# Altium schematic sheet Fly-Back.SchDoc
size A4; DocumentNumber: 3; SheetNumber: 3; SheetTotal: 5
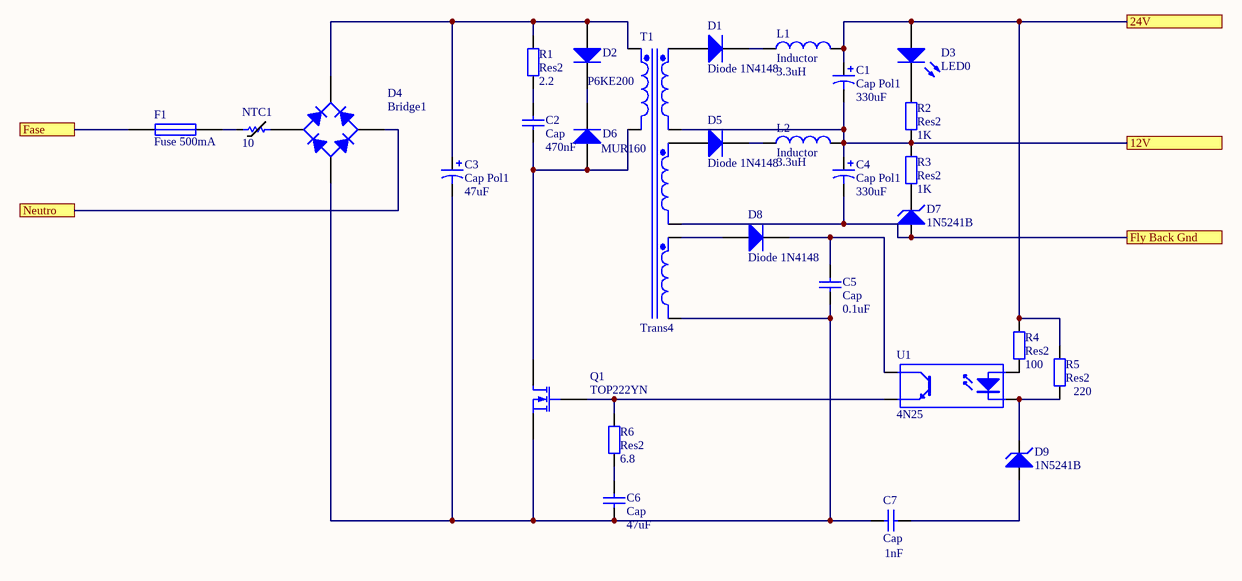
[diagram p0: Fly-Back.SchDoc]

## Parts
C1  Cap Pol1  value 330uF  [RB7.6-15]
C2  Cap  value 470nF  [RAD-0.3]
C3  Cap Pol1  value 47uF  [RB7.6-15]
C4  Cap Pol1  value 330uF  [RB7.6-15]
C5  Cap  value 0.1uF  [RAD-0.3]
C6  Cap  value 47uF  [RAD-0.3]
C7  Cap  value 1nF  [RAD-0.3]
D1  Diode 1N4148  [DO-35]
D2  P6KE200  [DO-35]
D3  LED0  [LED-0]
D4  Bridge1  [D-38]
D5  Diode 1N4148  [DO-35]
D6  MUR160  [DO-35]
D7  VALOR: 1N5241B  [DO-41]  (hidden comment: Diodo Zener)
D8  Diode 1N4148  [DO-35]
D9  VALOR: 1N5241B  [DO-41]  (hidden comment: Diodo Zener)
F1  Fuse 500mA  [PIN-W2/E2.8]
L1  Inductor  value 3.3uH  [0402-A]
L2  Inductor  value 3.3uH  [0402-A]
NTC1  VALOR: 10  [R0805]  (hidden comment: Termistor NTC)
Q1  TOP222YN  [E3]
R1  Res2  value 2.2  [AXIAL-0.4]
R2  Res2  value 1K  [AXIAL-0.4]
R3  Res2  value 1K  [AXIAL-0.4]
R4  Res2  value 100  [AXIAL-0.4]
R5  Res2  value 220  [AXIAL-0.4]
R6  Res2  value 6.8  [AXIAL-0.4]
T1  Trans4  [TRF_8]
U1  4N25  [DIP-4]

## Ports
12V, 24V, Fase, Fly Back Gnd, Neutro

## Nets
12V: C1.2 C4.1 L2.2 R2.1 R3.2 T1.4(Sec1-) ; port 12V
24V: C1.1 D3.1(A) L1.2 R4.2 R5.2 ; port 24V
Fase: F1.1 ; port Fase
Fly Back Gnd: C4.2 D7.1(A) T1.6(Sec2-) ; port Fly Back Gnd
Neutro: D4.2(C) ; port Neutro
NetC2_1: C2.1 D6.1(A) Q1.1(D) T1.2(Pri-)
NetC2_2: C2.2 R1.1
NetC3_1: C3.1 D2.1(A) D4.1(K) R1.2 T1.1(Pri+)
NetC3_2: C3.2 C5.1 C6.1 C7.1 D4.3(A) Q1.3(S) T1.8(Sec3-)
NetC5_2: C5.2 D8.2(K) U1.4(C)
NetC6_2: C6.2 R6.1
NetC7_2: C7.2 D9.1(A)
NetD1_1: D1.1(A) T1.3(Sec1+)
NetD1_2: D1.2(K) L1.1
NetD2_2: D2.2(K) D6.2(K)
NetD3_2: D3.2(K) R2.2
NetD4_4: D4.4(C) NTC1.1
NetD5_1: D5.1(A) T1.5(Sec2+)
NetD5_2: D5.2(K) L2.1
NetD7_2: D7.2(K) R3.1
NetD8_1: D8.1(A) T1.7(Sec3+)
NetD9_2: D9.2(K) R5.1 U1.2(K)
NetF1_2: F1.2 NTC1.2
NetQ1_2: Q1.2(G) R6.2 U1.3(E)
NetR4_1: R4.1 U1.1(A)

## Library data of the parts
C1 C3 C4 = Cap Pol1: Polarized Capacitor (Radial); Published: 8-Jun-2000; LatestRevisionDate: 17-Jul-2002; LatestRevisionNote: Re-released for DXP Platform.; PackageReference: RB7.6-15; Publisher: Altium Limited; PackageDescription: Polarized Capacitor (Radial); 2 Leads
C2 C5-C7 = Cap: Capacitor; Published: 8-Jun-2000; LatestRevisionDate: 17-Jul-2002; LatestRevisionNote: Re-released for DXP Platform.; PackageReference: RAD-0.3; Publisher: Altium Limited; PackageDescription: Radial Cap, Thru-Hole; 2 Leads; 0.3 in Pin Spacing
D1 D2 D5 D6 D8 = Diode 1N4148: High Conductance Fast Diode; Published: 8-Jun-2000; LatestRevisionDate: 17-Jul-2002; LatestRevisionNote: Re-released for DXP Platform.; DatasheetVersion: 1997; PackageReference: DO-35; Publisher: Altium Limited; PackageDescription: Diode, Axial; Body 3.8 x 1.9 mm (LxDia. max), Lead Dia. 0.53 mm (max); Code_JEDEC: DO-204-AH; ComponentLink1Description: Manufacturer Link; ComponentLink1URL: http://www.fairchildsemi.com/; ComponentLink2Description: Datasheet; ComponentLink2URL: http://www.fairchildsemi.com/ds/1N%2F1N4148.pdf
D3 = LED0: Typical INFRARED GaAs LED; Published: 8-Jun-2000; LatestRevisionDate: 08-Jul-2005; LatestRevisionNote: Mech Layer 1 removed.; PackageReference: LED-0; Publisher: Altium Limited; PackageDescription: LED; 2 Leads
D4 = Bridge1: Full Wave Diode Bridge; Published: 8-Jun-2000; LatestRevisionDate: 29-May-2009; LatestRevisionNote: Sch pins A & K swapped.; DatasheetVersion: E2732B; PackageReference: D-38; Publisher: Altium Limited; PackageDescription: Bridge Rectifier; 4 Terminals; Body 9.4 x 9.4 mm (typ); Pitch 5.08 mm
F1 = Fuse 1: Fuse; Published: 8-Jun-2000; LatestRevisionDate: 17-Jul-2002; LatestRevisionNote: Re-released for DXP Platform.; PackageReference: PIN-W2/E2.8; Publisher: Altium Limited; PackageDescription: Thru-Hole; 2 Leads
L1 L2 = Inductor: Code_IEC: 1005; Published: 8-Jun-2000; LatestRevisionDate: 29-May-2009; LatestRevisionNote: IPC-7351 Footprint Added.; PackageReference: 0402-A; Publisher: Altium Limited; PackageDescription: Chip Inductor; Code_JEITA: 0402
NTC1 = Termistor NTC: Termistor NTC SMD; PROVEEDOR: *; CODIGO STI: *; FABRICANTE: *
Q1 = MOSFET-N: N-Channel MOSFET; Published: 8-Jun-2000; LatestRevisionDate: 17-Jul-2002; LatestRevisionNote: Re-released for DXP Platform.; PackageVersion: 1995/1996; PackageReference: E3; Publisher: Altium Limited; PackageDescription: TO, Flat Index; 3 In-Line, Axial Leads; Body Dia. 4.6mm; Lead Dia. 0.5 mm (max)
R1-R6 = Res2: Resistor; Published: 8-Jun-2000; LatestRevisionDate: 17-Jul-2002; LatestRevisionNote: Re-released for DXP Platform.; PackageReference: AXIAL-0.4; Publisher: Altium Limited; PackageDescription: Axial Device, Thru-Hole; 2 Leads; 0.4 in Pin Spacing
T1 = Trans4: Four-winding Transformer (Non-Ideal); Sim Note: Enter the turns ratios, Core loss resistance, Magnetising Reactance, Leakage Reactances and Resistances referred to the primary side into the parameter fields.; Published: 25-Jan-2001; LatestRevisionDate: 17-Jul-2002; LatestRevisionNote: Re-released for DXP Platform.; PackageReference: TRF_8; Publisher: Altium Limited; PackageDescription: Transformer; 8 Leads
U1 = Optoisolator1: 4-Pin Phototransistor Optocoupler; Published: 24-Mar-1999; LatestRevisionDate: 04-Mar-2005; LatestRevisionNote: Sch pins 3 & 4 Swapped.; DatasheetVersion: Nov-2003; PackageReference: DIP-4; Publisher: Altium Limited
D7 D9 = Diodo Zener: CODIGO STI: *; PROVEEDOR: *; FABRICANTE: *